# Altium schematic sheet 03_IO-CONNECTION.SchDoc
size 420 x 297 mm; Web: www.byte-lab.com; PageNumber: 03
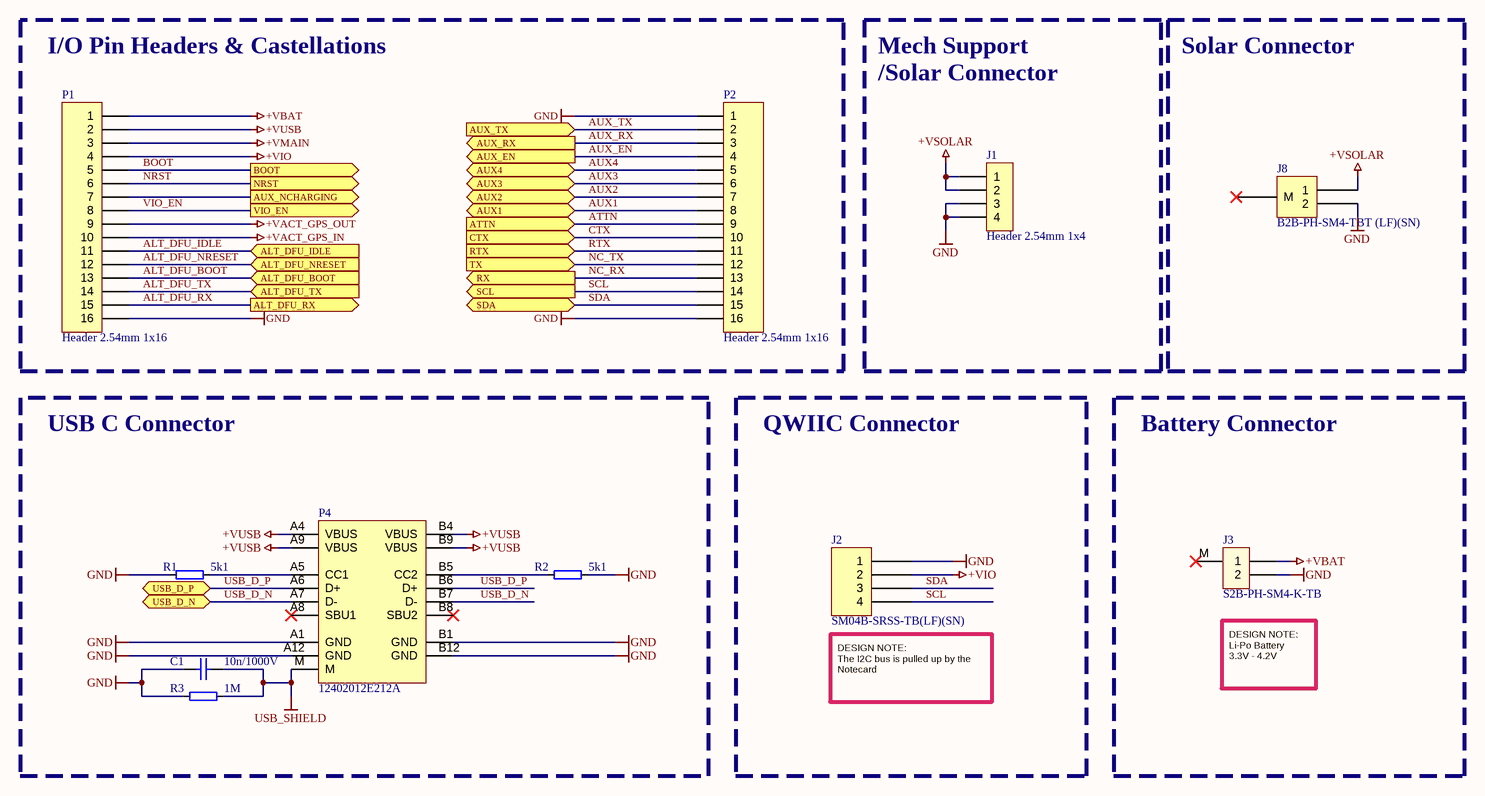
[diagram p0: 03_IO-CONNECTION.SchDoc]

## Parts
?  (no value)  (graphical)
C1  10n/1000V  [C-1206]
J1  Header 2.54mm 1x4  [Header 2.54mm 1X4]
J2  SM04B-SRSS-TB(LF)(SN)  [JST SM04B-SRSS-TB]
J3  S2B-PH-SM4-K-TB  [Conn S2B-PH-SM4]
J8  B2B-PH-SM4-TBT (LF)(SN)  [CONN2_B2B-PH-SM4_JST]
P1  Header 2.54mm 1x16  [Header 2.54mm 1X16]
P2  Header 2.54mm 1x16  [Header 2.54mm 1X16]
P4  12402012E212A  [CONN_12402012E212A]
R1  5k1  [R-0402]
R2  5k1  [R-0402]
R3  1M  [R-1206]

## Blocks framed on the sheet
I/O Pin Headers & Castellations: P1 P2
Solar Connector: J8
USB C Connector: C1 P4 R1-R3
QWIIC Connector: J2
Battery Connector: J3

## Ports
ALT_DFU_BOOT (in), ALT_DFU_IDLE (in), ALT_DFU_NRESET (in), ALT_DFU_RX (out), ALT_DFU_TX (in), ATTN (in), AUX1 (bidir), AUX2 (bidir), AUX3 (bidir), AUX4 (bidir), AUX_EN (out), AUX_NCHARGING (out), AUX_RX (out), AUX_TX (in), BOOT (out), CTX (in), NRST (out), RTX (in), RX (out), SCL (out), SDA (bidir), TX (in), USB_D_N (bidir), USB_D_P (bidir), VIO_EN (out)

## Nets
+VACT_GPS_IN: P1.10
+VACT_GPS_OUT: P1.9
+VBAT: J3.1 P1.1
+VIO: J2.2 P1.4
+VMAIN: P1.3
+VSOLAR: J1.1 J1.2 J8.1
+VUSB: P1.2 P4.A4(VBUS) P4.A9(VBUS) P4.B4(VBUS) P4.B9(VBUS)
GND: C1.2 J1.3 J1.4 J2.1 J3.2 J8.2 P1.16 P2.1 P2.16 P4.A1(GND) P4.A12(GND) P4.B1(GND) P4.B12(GND) R1.1 R2.2 R3.2
USB_SHIELD: C1.1 P4.M R3.1
ALT_DFU_BOOT: P1.13 ; port ALT_DFU_BOOT
ALT_DFU_IDLE: P1.11 ; port ALT_DFU_IDLE
ALT_DFU_NRESET: P1.12 ; port ALT_DFU_NRESET
ALT_DFU_RX: P1.15 ; port ALT_DFU_RX
ALT_DFU_TX: P1.14 ; port ALT_DFU_TX
ATTN: P2.9 ; port ATTN
AUX1: P2.8 ; port AUX1
AUX2: P2.7 ; port AUX2
AUX3: P2.6 ; port AUX3
AUX4: P2.5 ; port AUX4
AUX_EN: P2.4 ; port AUX_EN
AUX_NCHARGING: P1.7 ; port AUX_NCHARGING
AUX_RX: P2.3 ; port AUX_RX
AUX_TX: P2.2 ; port AUX_TX
BOOT: P1.5 ; port BOOT
CTX: P2.10 ; port CTX
NC_RX: P2.13 ; port RX
NC_TX: P2.12 ; port TX
NRST: P1.6 ; port NRST
RTX: P2.11 ; port RTX
SCL: J2.4 P2.14 ; port SCL
SDA: J2.3 P2.15 ; port SDA
USB_D_N: P4.A7(D-) P4.B7(D-) ; port USB_D_N
USB_D_P: P4.A6(D+) P4.B6(D+) ; port USB_D_P
VIO_EN: P1.8 ; port VIO_EN
NetP4_A5: P4.A5(CC1) R1.2
NetP4_B5: P4.B5(CC2) R2.1

Not connected (* = marked no-connect by the designer): J3 M*; J8 M*; P4 A8(SBU1)* B8(SBU2)*

## Notes on the sheet
- Mech Support
- /Solar Connector
- (near J3) DESIGN NOTE:
  Li-Po Battery
  3.3V - 4.2V
- (near J2) DESIGN NOTE:
  The I2C bus is pulled up by the Notecard
- Board
- Project
- Page name
- Project Code
- Designer
- Internal Code
- Approved
- Customer
- Code
- Il presente progetto è tutelato dalla legge sul diritto d'autore, che vieta a terzi la riproduzione e l'utilizzo anche parziale senza il consenso di FAE Technology S.p.A.
- Data
- Rev.
- Rev. changes
- Sheet
- /

## Library data of the parts
? = MyFAETechnology
C1 = C1206-10n-1000V-X7R - CS1206KKX7RCBB103: Capacitor ceramic 10n ±10% X7R 1000V 1206; BL Part Number: 2007-449; Manufacturer: YAGEO; Drawn_By: Hamin; Checked_By: Marsic; Manufacturer Part Number: CS1206KKX7RCBB103; DateModified: 03-05-2023; Supplier 1: Digi-Key; Supplier Part Number 1: 311-3578-1-ND; Note: *
J1 = Conn Header 2.54mm 1X4: 2.54mm pitch 4 pin (1x4) top entry wire to board connector THT; BL Part Number: 2001-524; Manufacturer: Wurth; Manufacturer Part Number: 61300411121; Drawn_By: Puskar; Checked_By: Dodig; Note: *; DateModified: 29-01-2024; Pkg Type: THT
J2 = SM04B-SRSS-TB(LF)(SN): CONN HEADER SH 4POS SIDE 1MM TIN; Manufacturer: JST Sales America Inc.; BL Part Number: 2002-058; Drawn_By: Blues Wireless; Supplier 1: Digi-Key; Manufacturer Part Number: SM04B-SRSS-TB(LF)(SN); Supplier Part Number 1: 455-1804-1-ND
J3 = Conn S2B-PH-SM4-K-TB: 2.00mm pitch 2 pin side entry wire to board connector, SMD; BL Part Number: 2007-662; Manufacturer: JST; Manufacturer Part Number: S2B-PH-SM4-K-TB(LF)(SN); Drawn_By: Hamin; DateModified: 19-06-2023; Checked_By: *; Supplier 1: Digi-Key; Supplier Part Number 1: *; Note: *
J8 = Conn B2B-PH-SM4-TBT (LF)(SN): CONN HEADER SH 2POS VERT 2MM TIN; Manufacturer: JST Sales America Inc.; Pkg Type: SMD; Manufacturer Part Number: B2B-PH-SM4-TBT
P1 P2 = Conn Header 2.54mm 1X16: 2.54mm pitch 16 pin (1x16) top entry wire to board connector THT; BL Part Number: 2001-478; Drawn_By: Puskar; Checked_By: Hamin; Note: *; Manufacturer: N/A; Manufacturer Part Number: N/A; DateModified: 07-12-2013
P4 = Conn USB C 12402012E212A: CONN RCP USB2.0 TYP C 24P SMD RA; BL Part Number: 2008-437; Manufacturer: Amphenol; Drawn_By: Anic-Ivicic; Checked_By: Hlupic; Note: *; Manufacturer Part Number: 12402012E212A; DateModified: 19-03-2024; Supplier 1: Digi-Key; Supplier Part Number 1: 664-12402012E212ATR-ND
R1 R2 = R0402-5k1-1: Resistor 5k1 ±1% 0402; Manufacturer Part Number: RC0402FR-075K1L; Manufacturer: YAGEO; BL Part Number: 2004-098; Checked_By: Hamin; Drawn_By: PuskarJ; Pkg Type: SMD; DateModified: 21-09-2018; Note: *; Supplier 1: Digi-Key; Supplier Part Number 1: P5.10KLCT-ND; Package: 0402
R3 = R1206-1M-1: Resistor 1M ±1% 1206; Manufacturer Part Number: CRG1206F1M0; Manufacturer: TE Connectivity Passive Product; BL Part Number: 2001-438; Checked_By: Golubic; Drawn_By: Zvonc; Pkg Type: SMD; DateModified: 01-07-2014; Package: 1206